# EasyEDA schematic SCH_Nucleo扩展板_V3_2022-10-20.json

## Sheets
1 连接器: TITLE: Sheet_1; REV: 1.0; Date: 2022-09-22; Sheet: 1/1; Company: Your Company
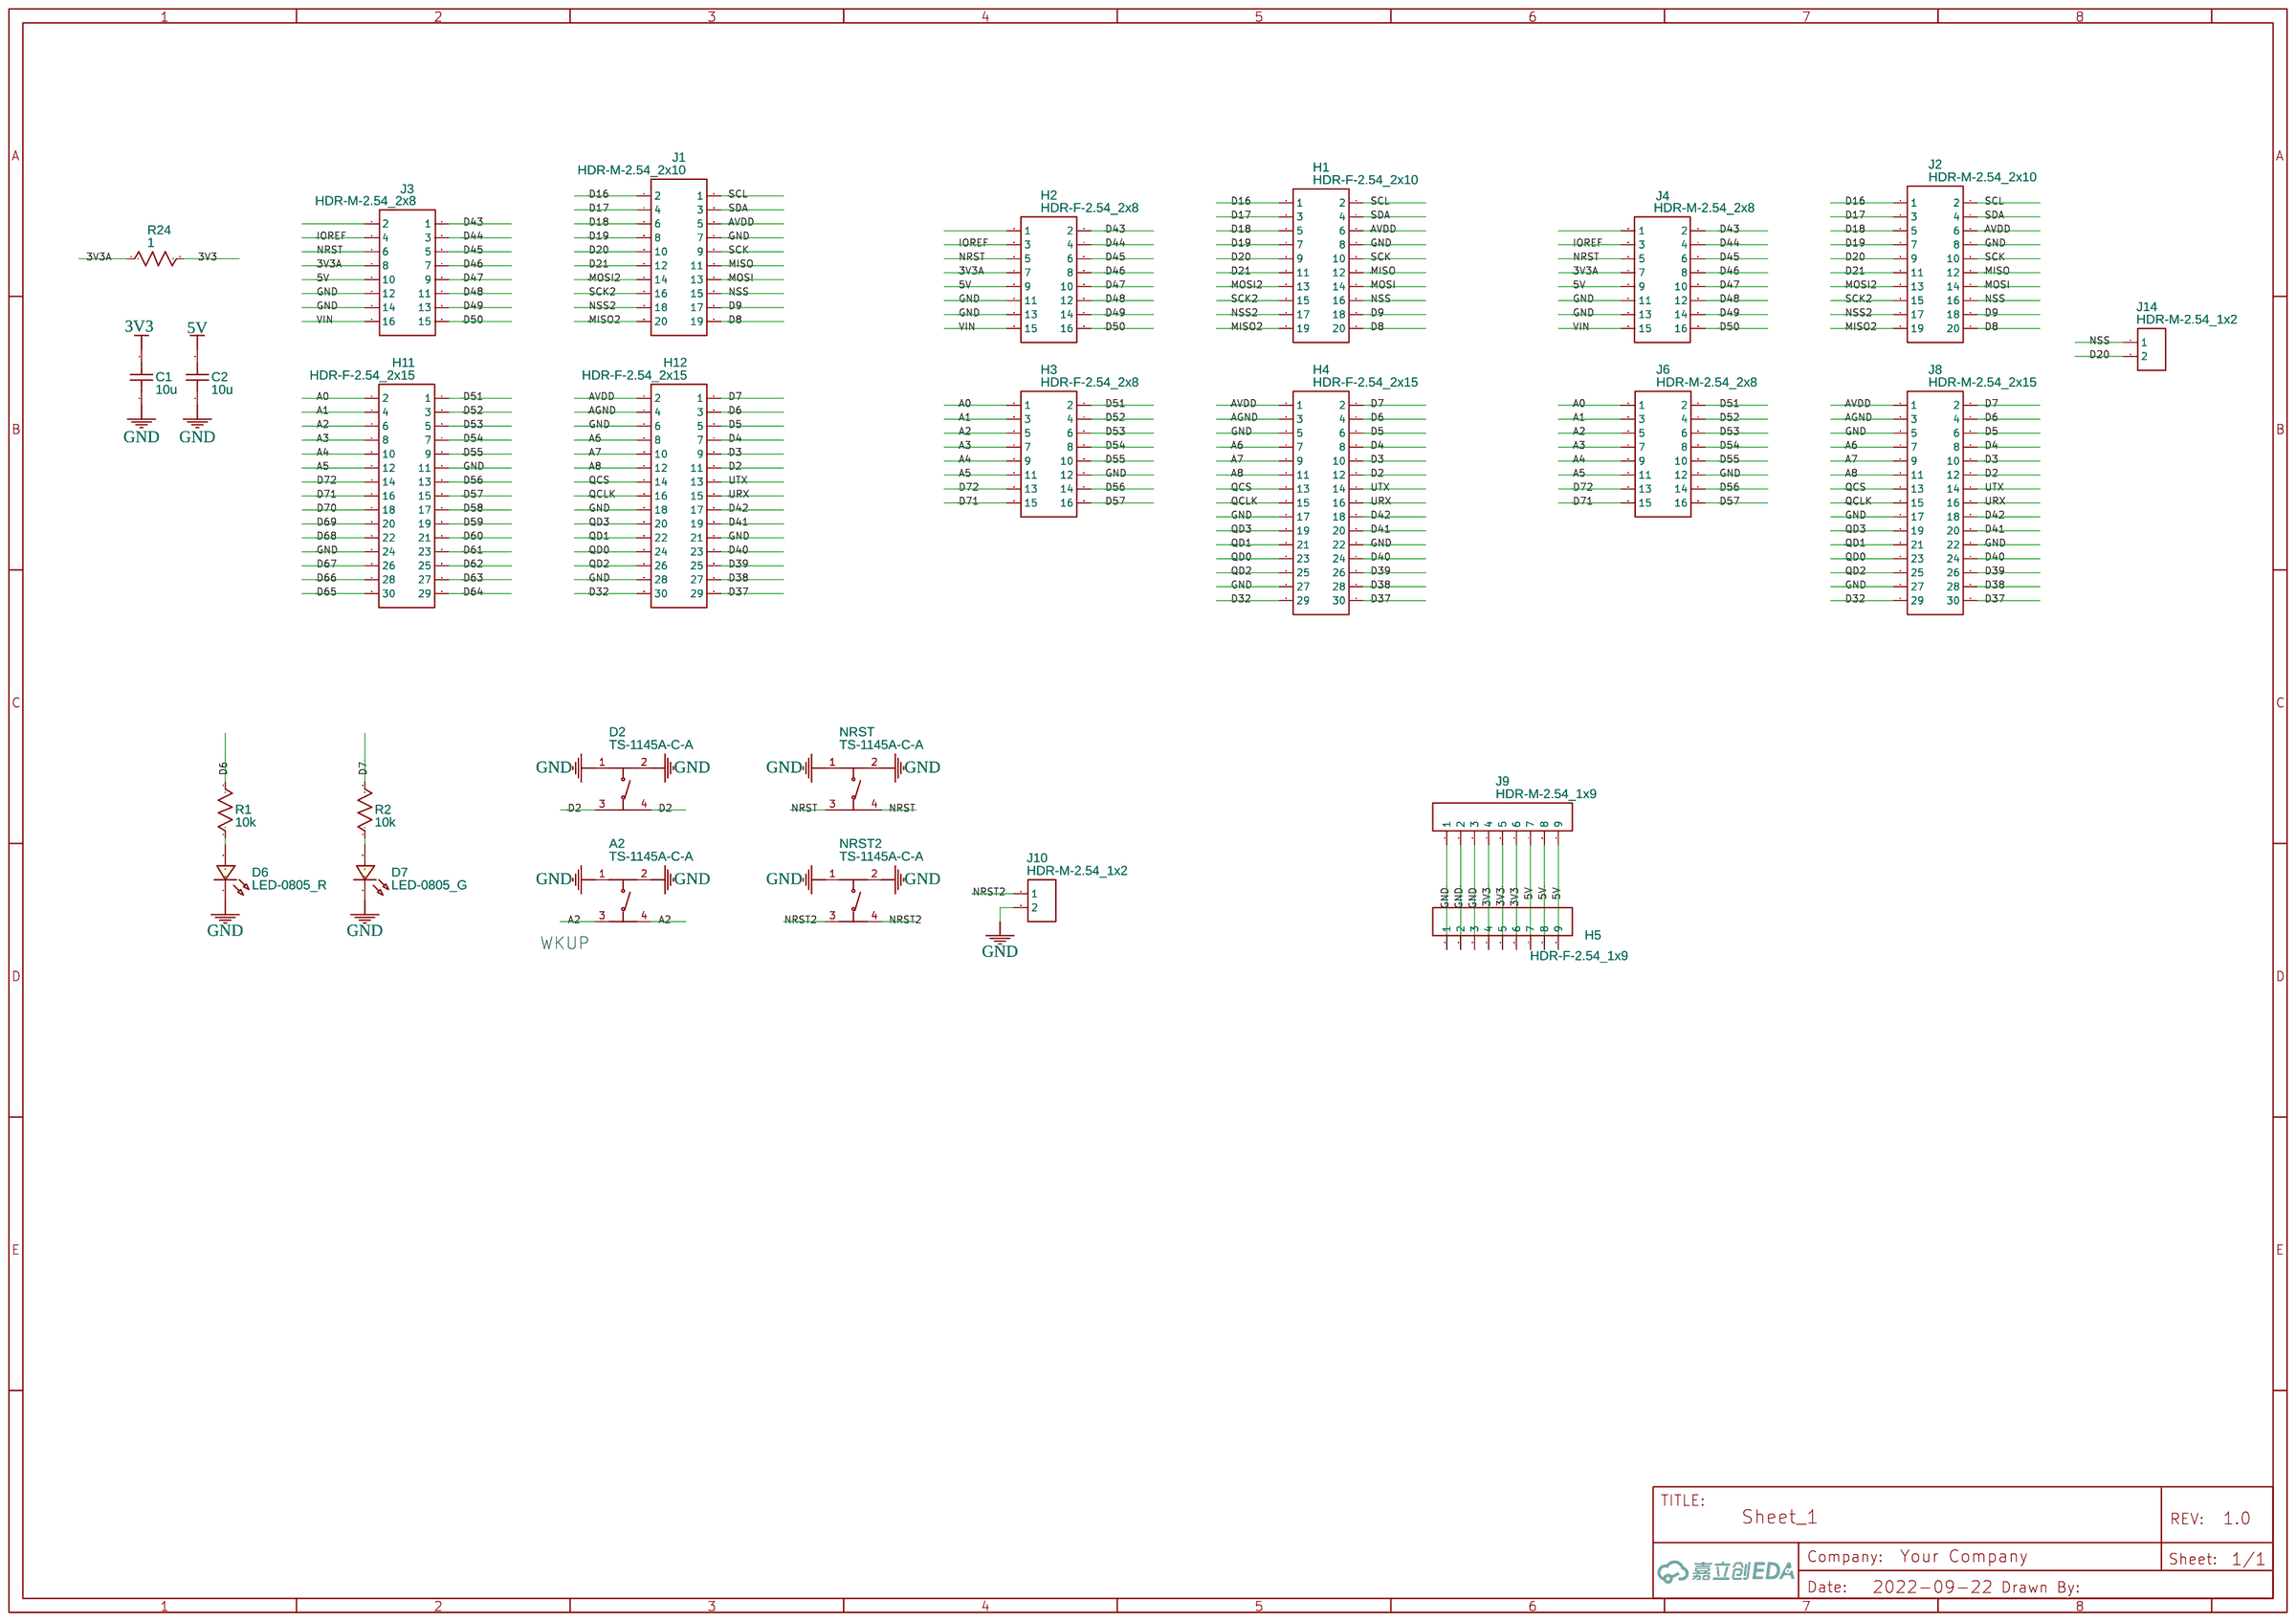
[diagram p0: 连接器]
2 存储: TITLE: Sheet_2; Date: 2022-09-23; Drawn By: minichao
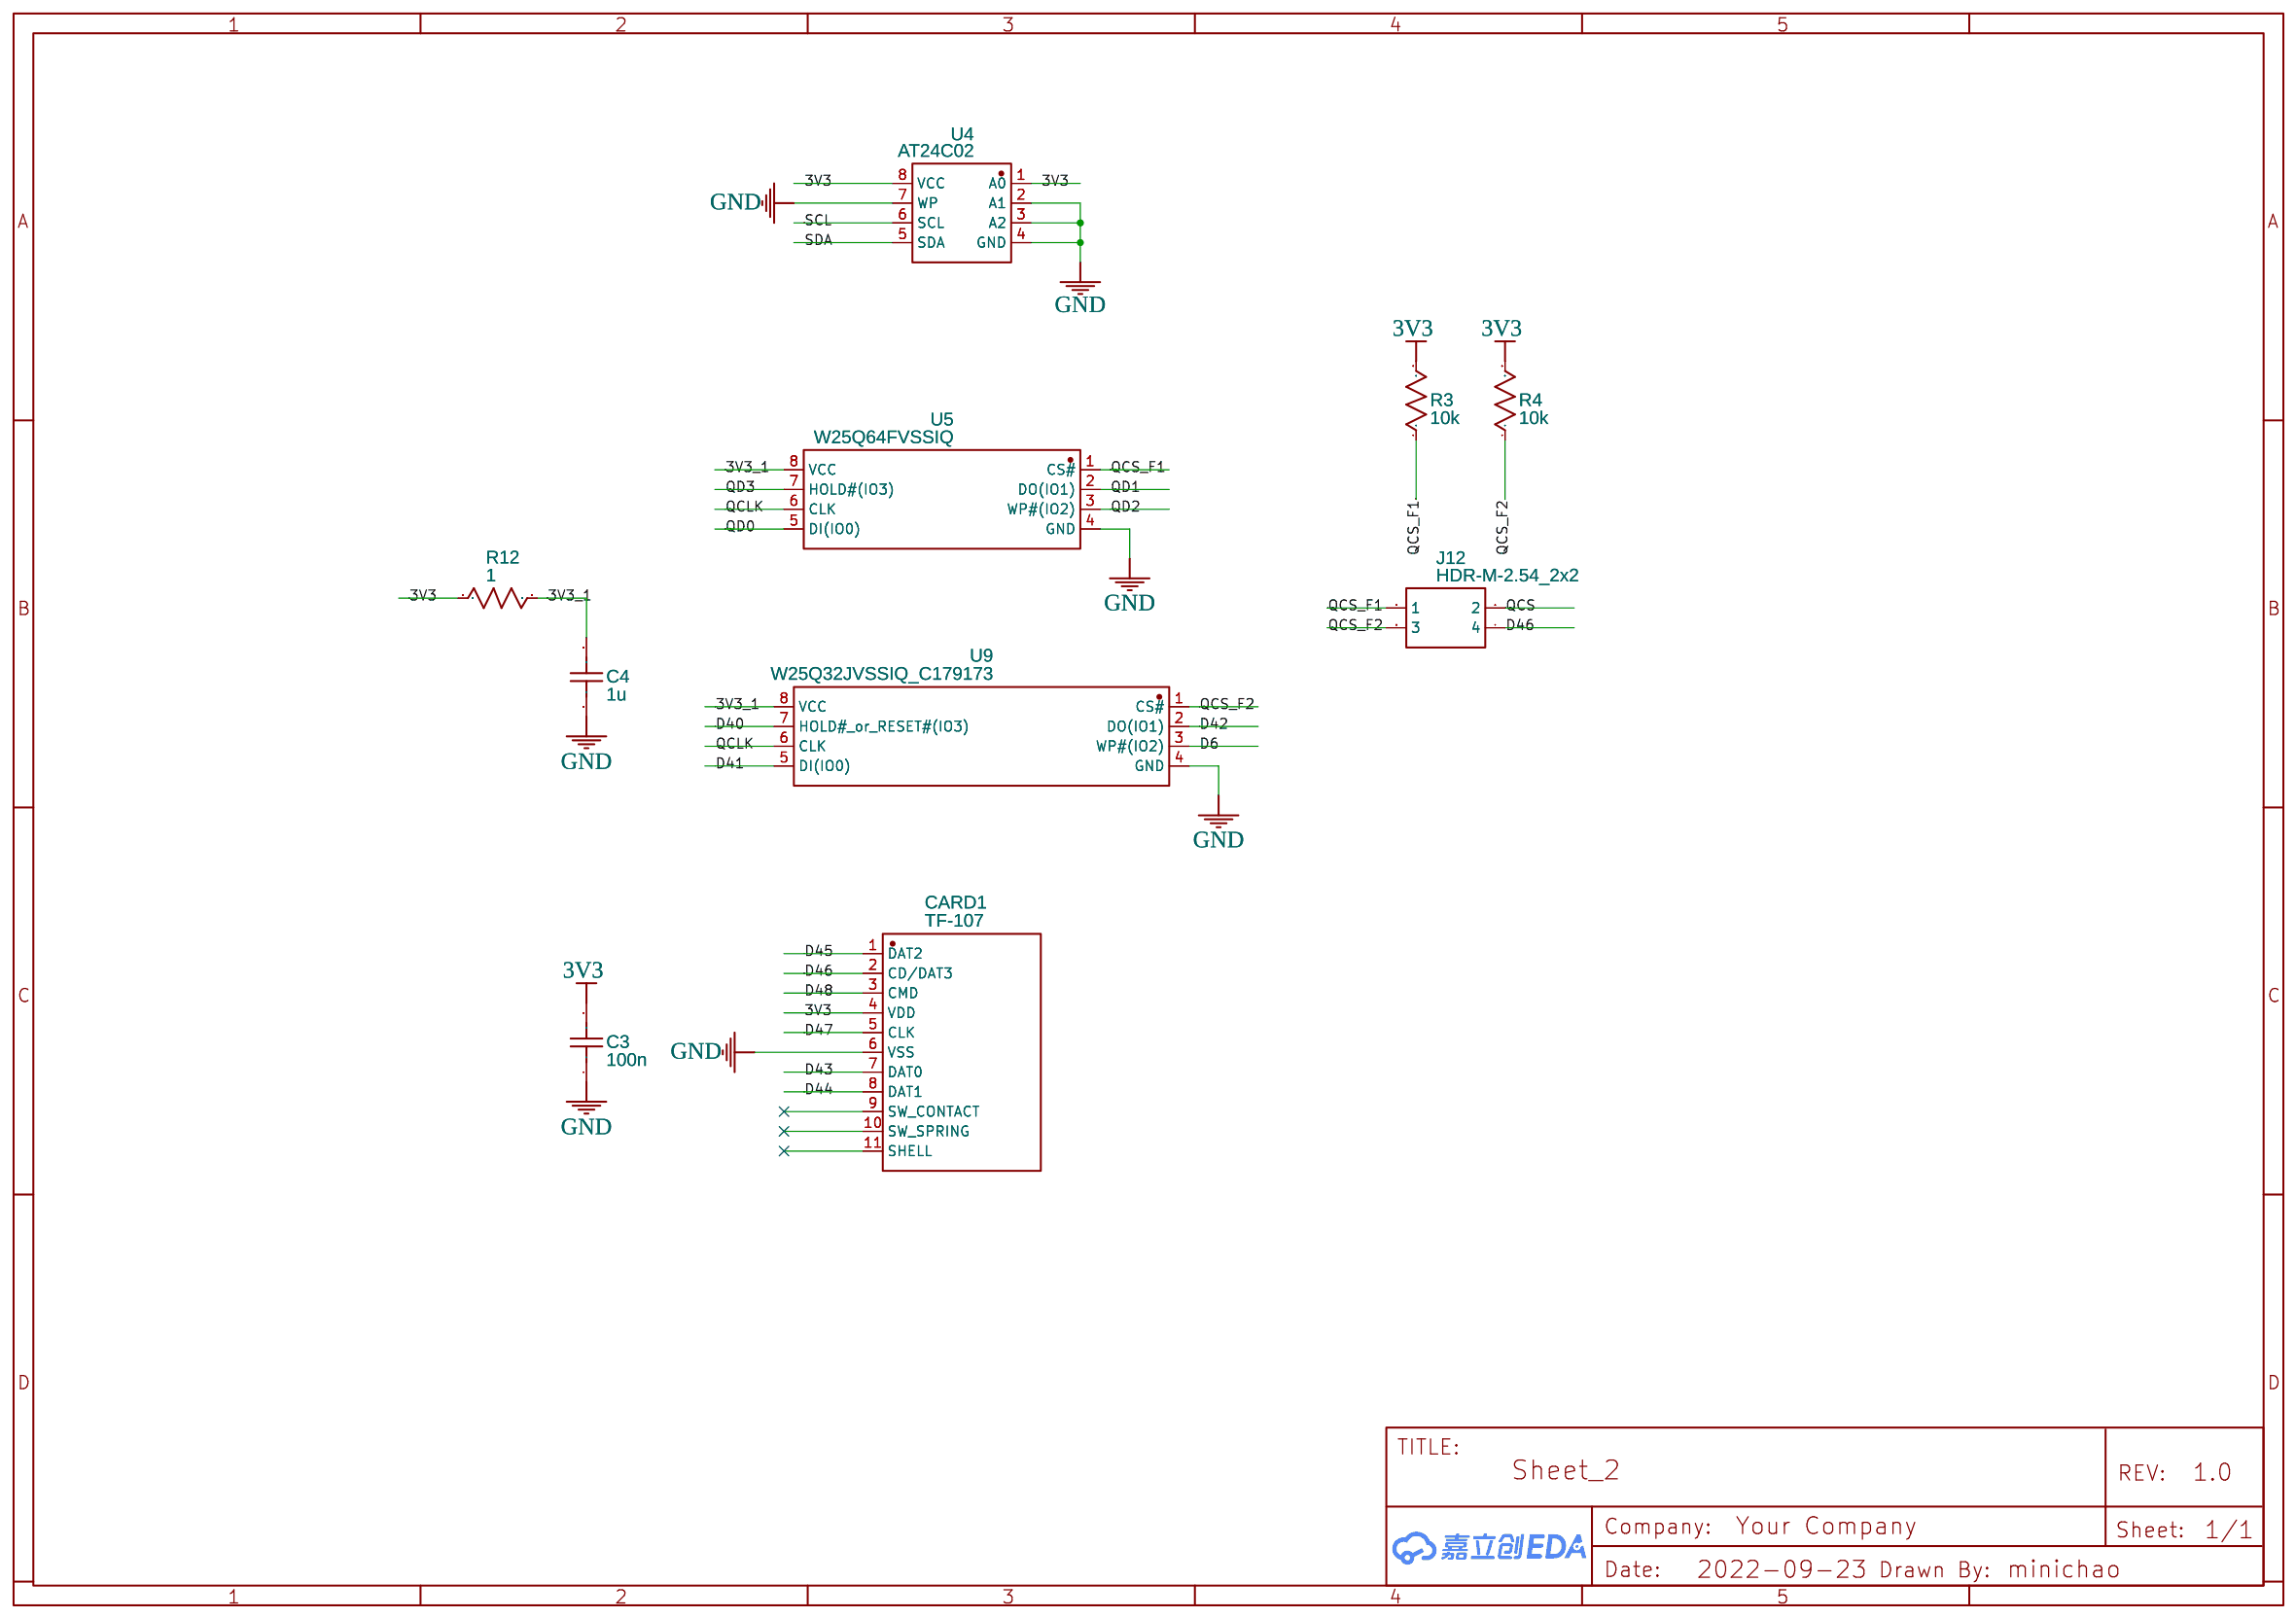
[diagram p1: 存储]
3 mcu: TITLE: Sheet_3; Date: 2022-09-29
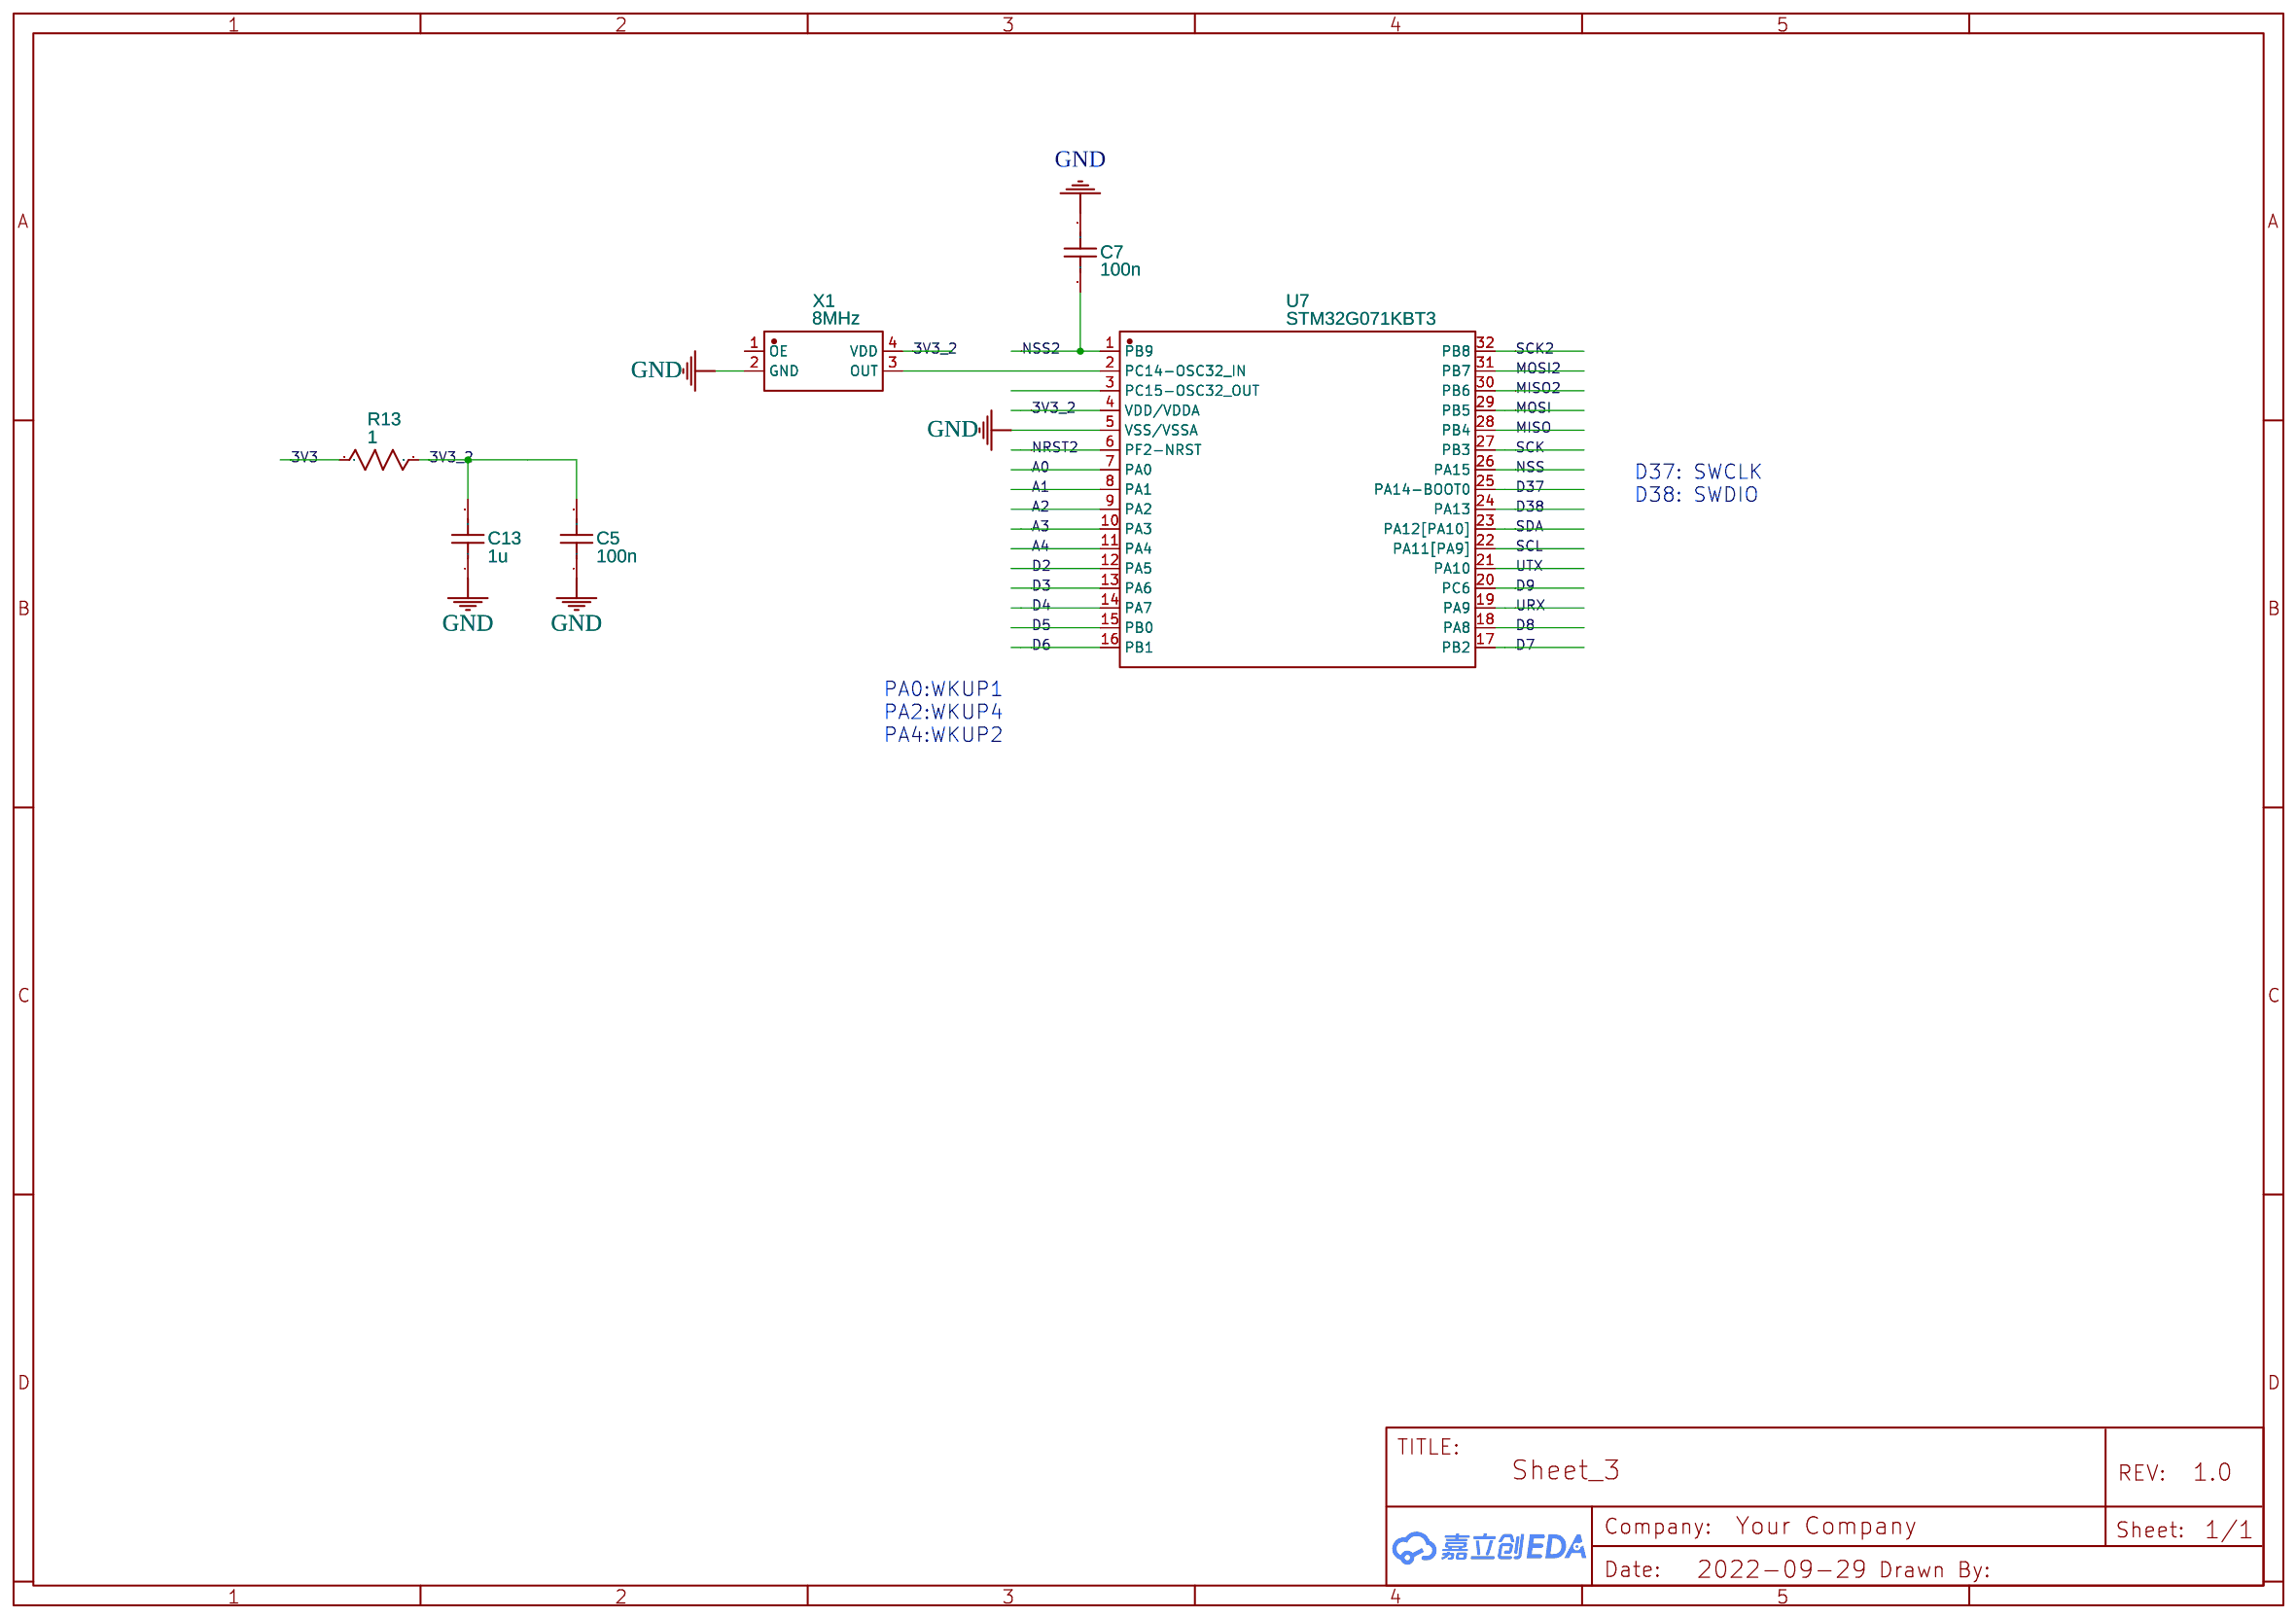
[diagram p2: mcu]
4 音频: Date: 2022-10-16
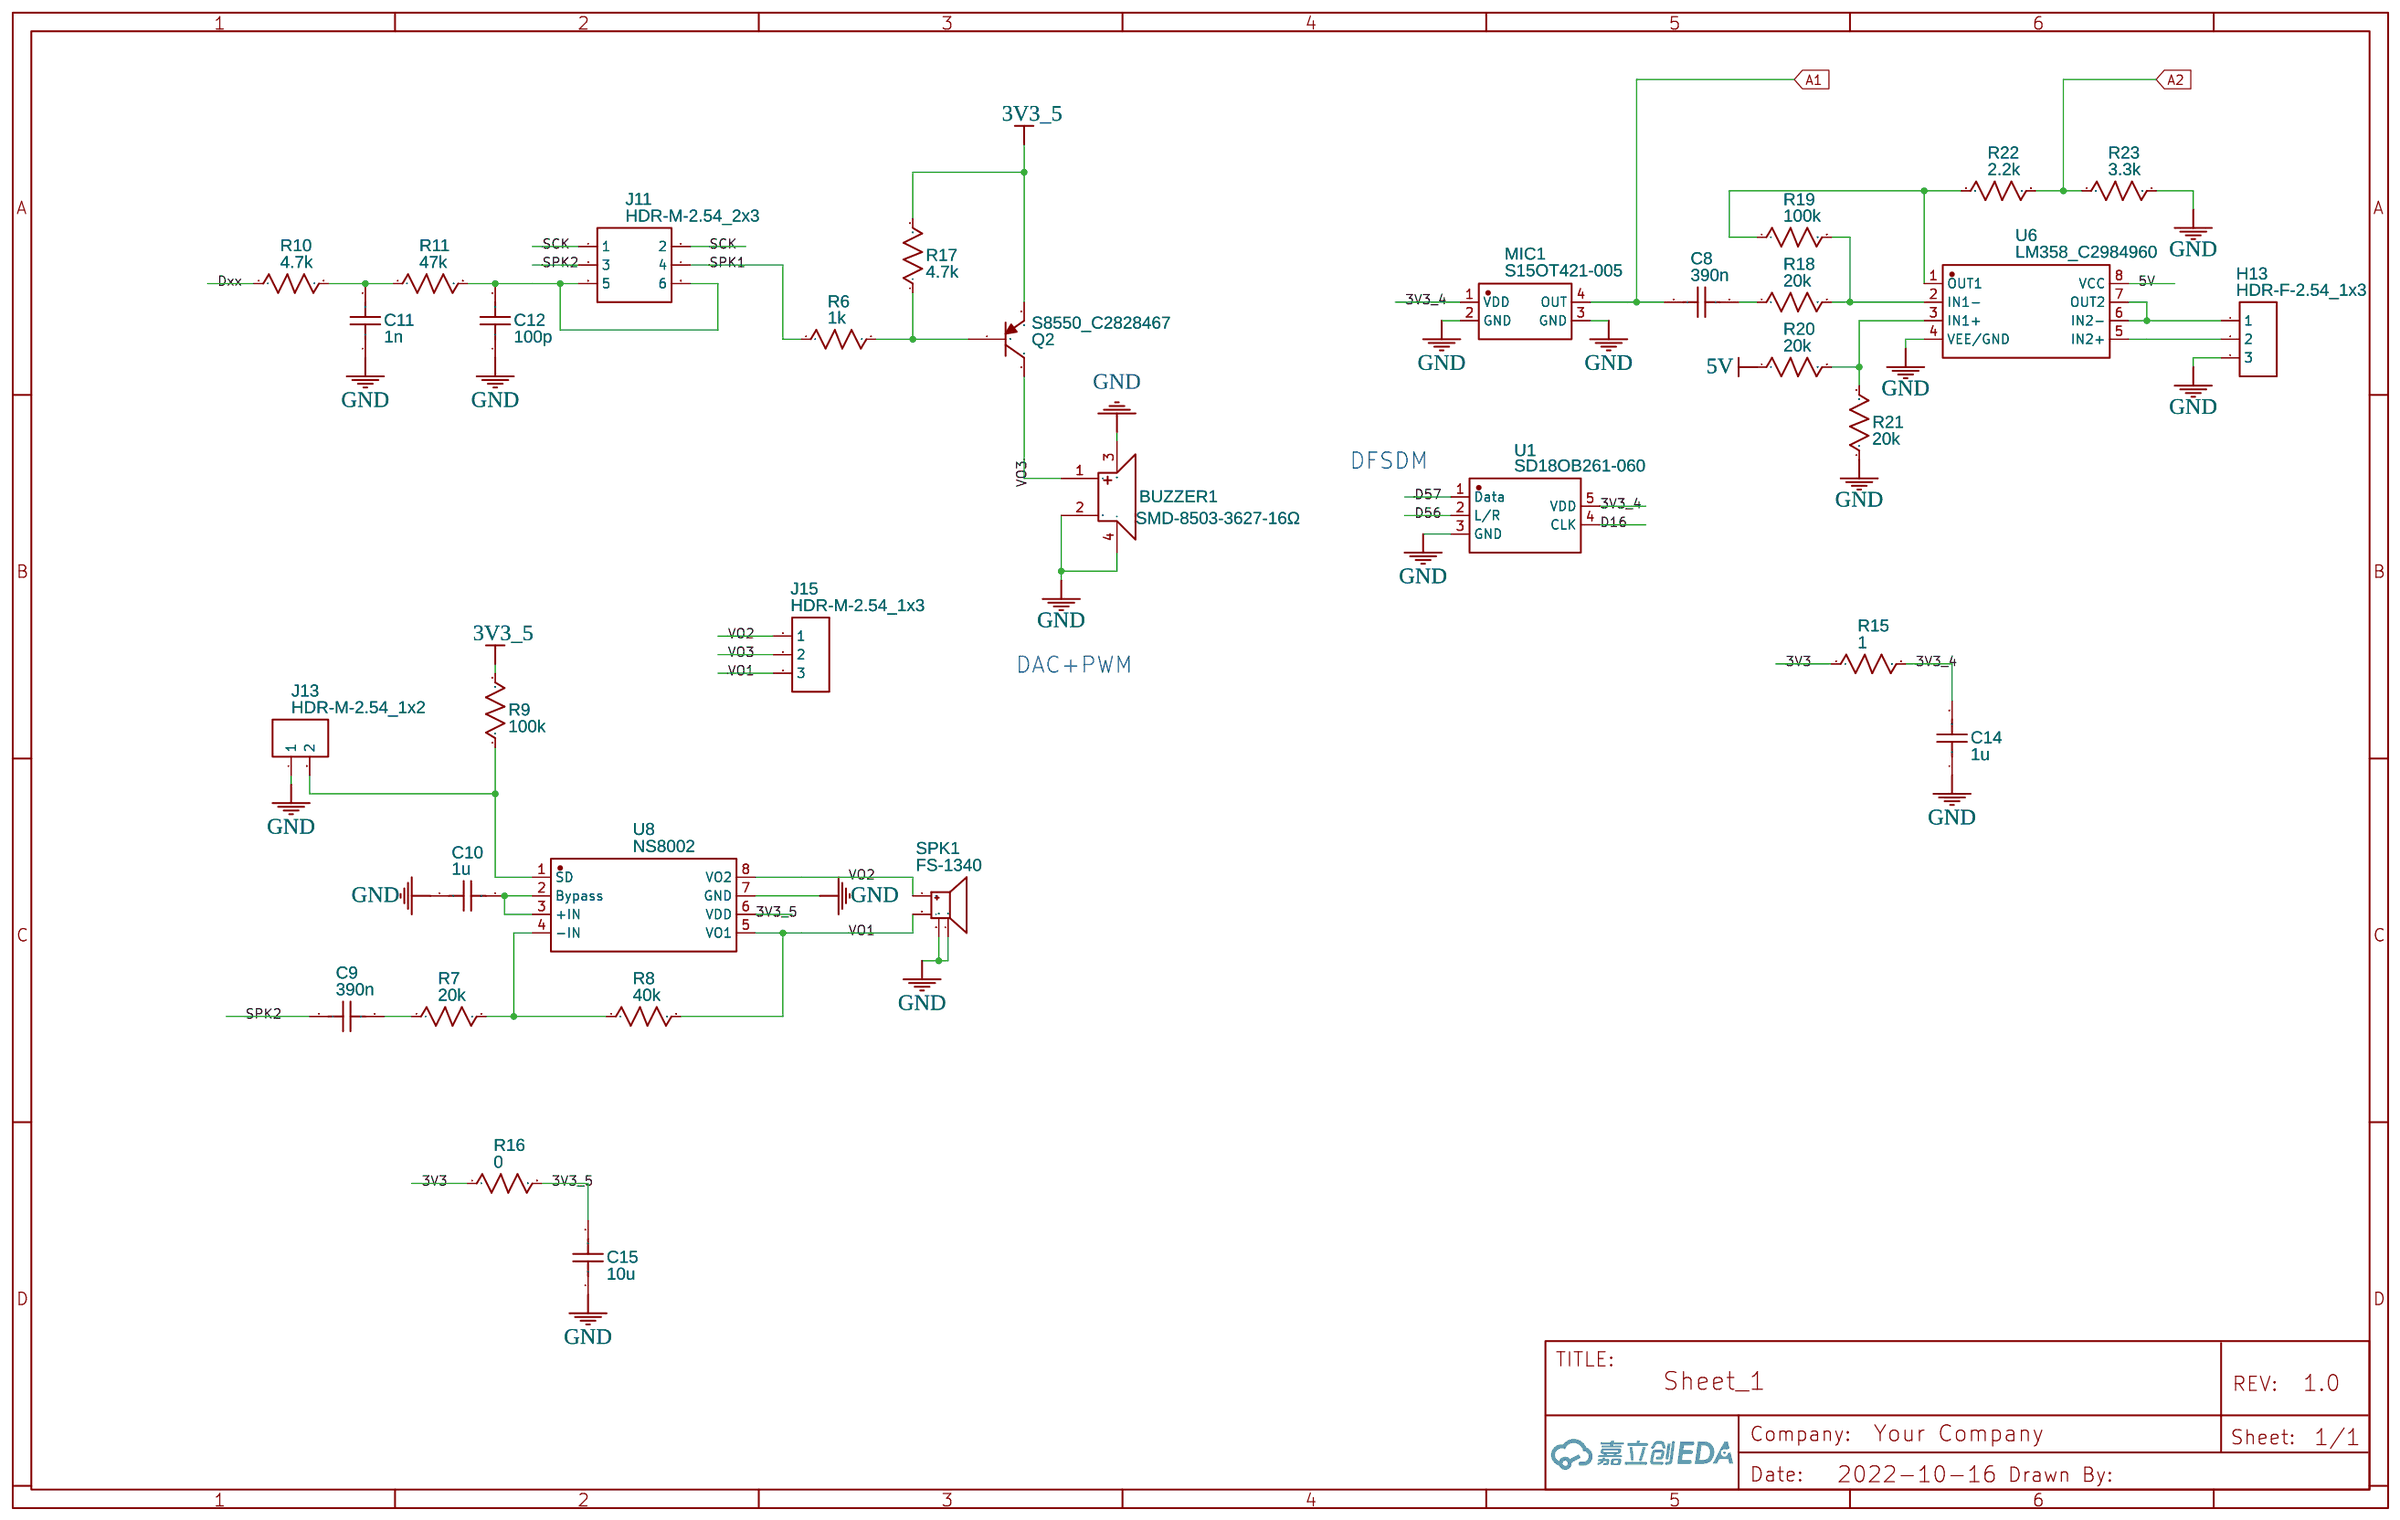
[diagram p3: 音频]
5 显示: Date: 2022-10-17
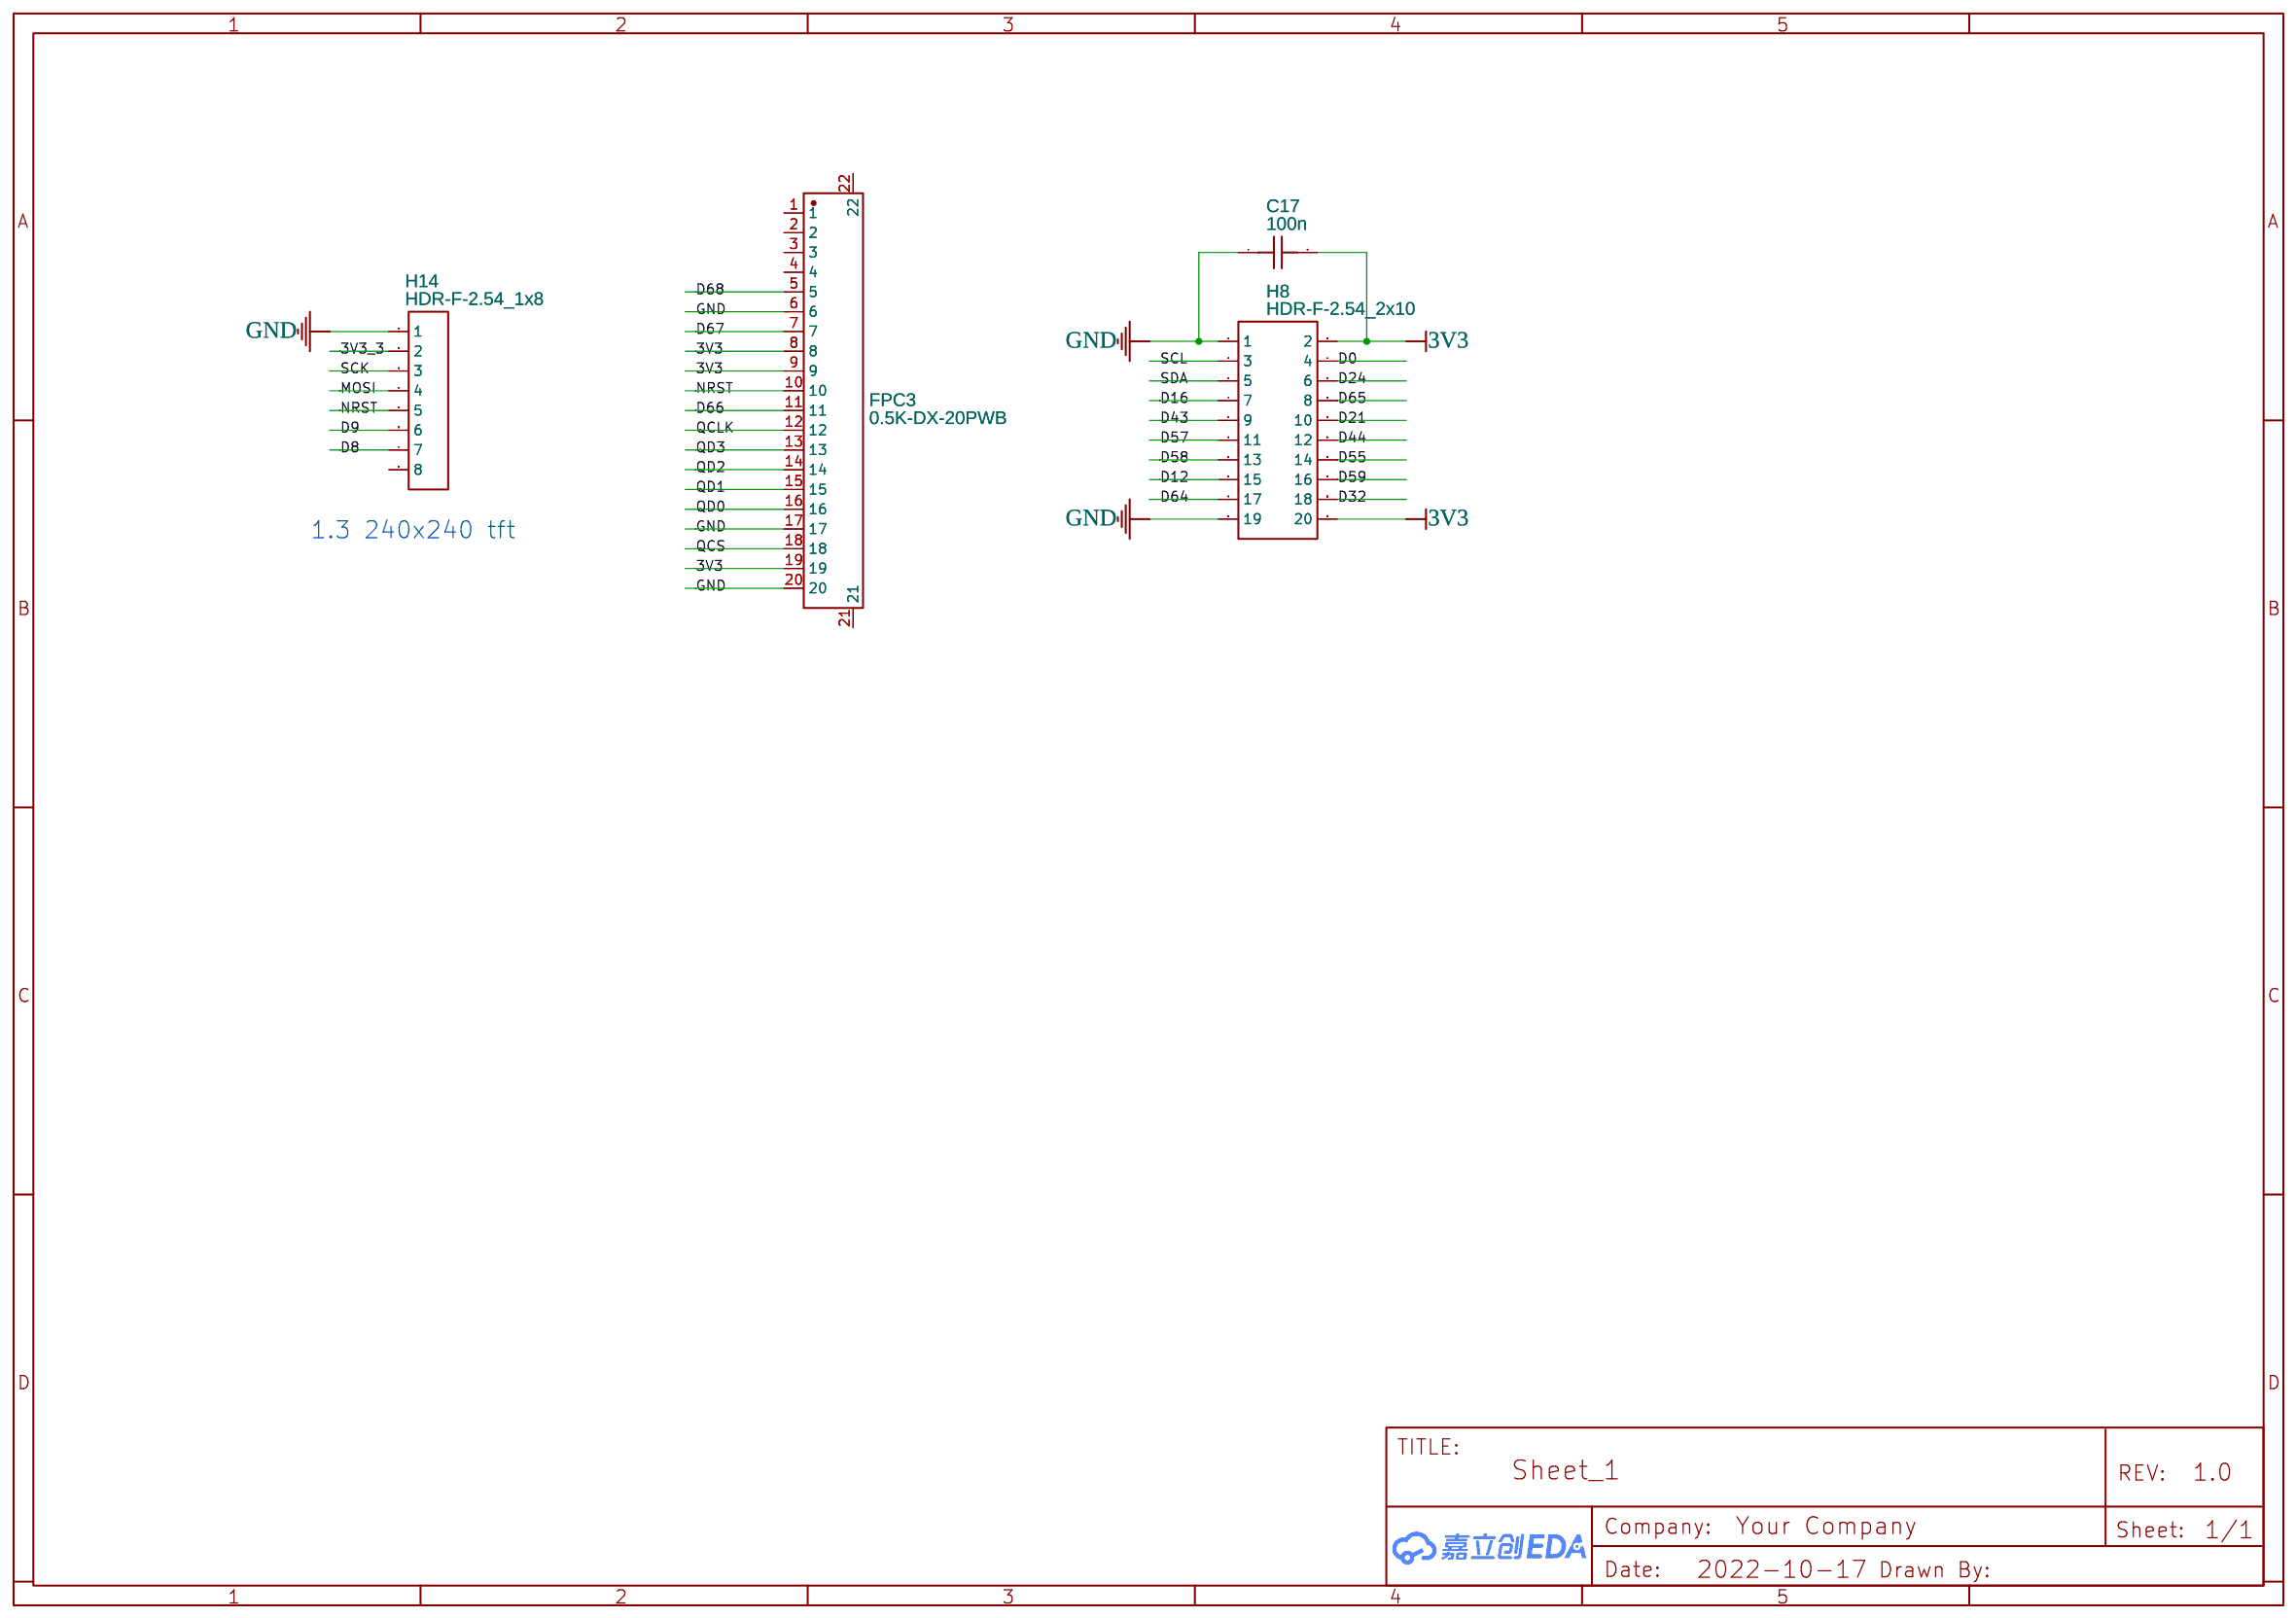
[diagram p4: 显示]
6 无线: Date: 2022-10-17
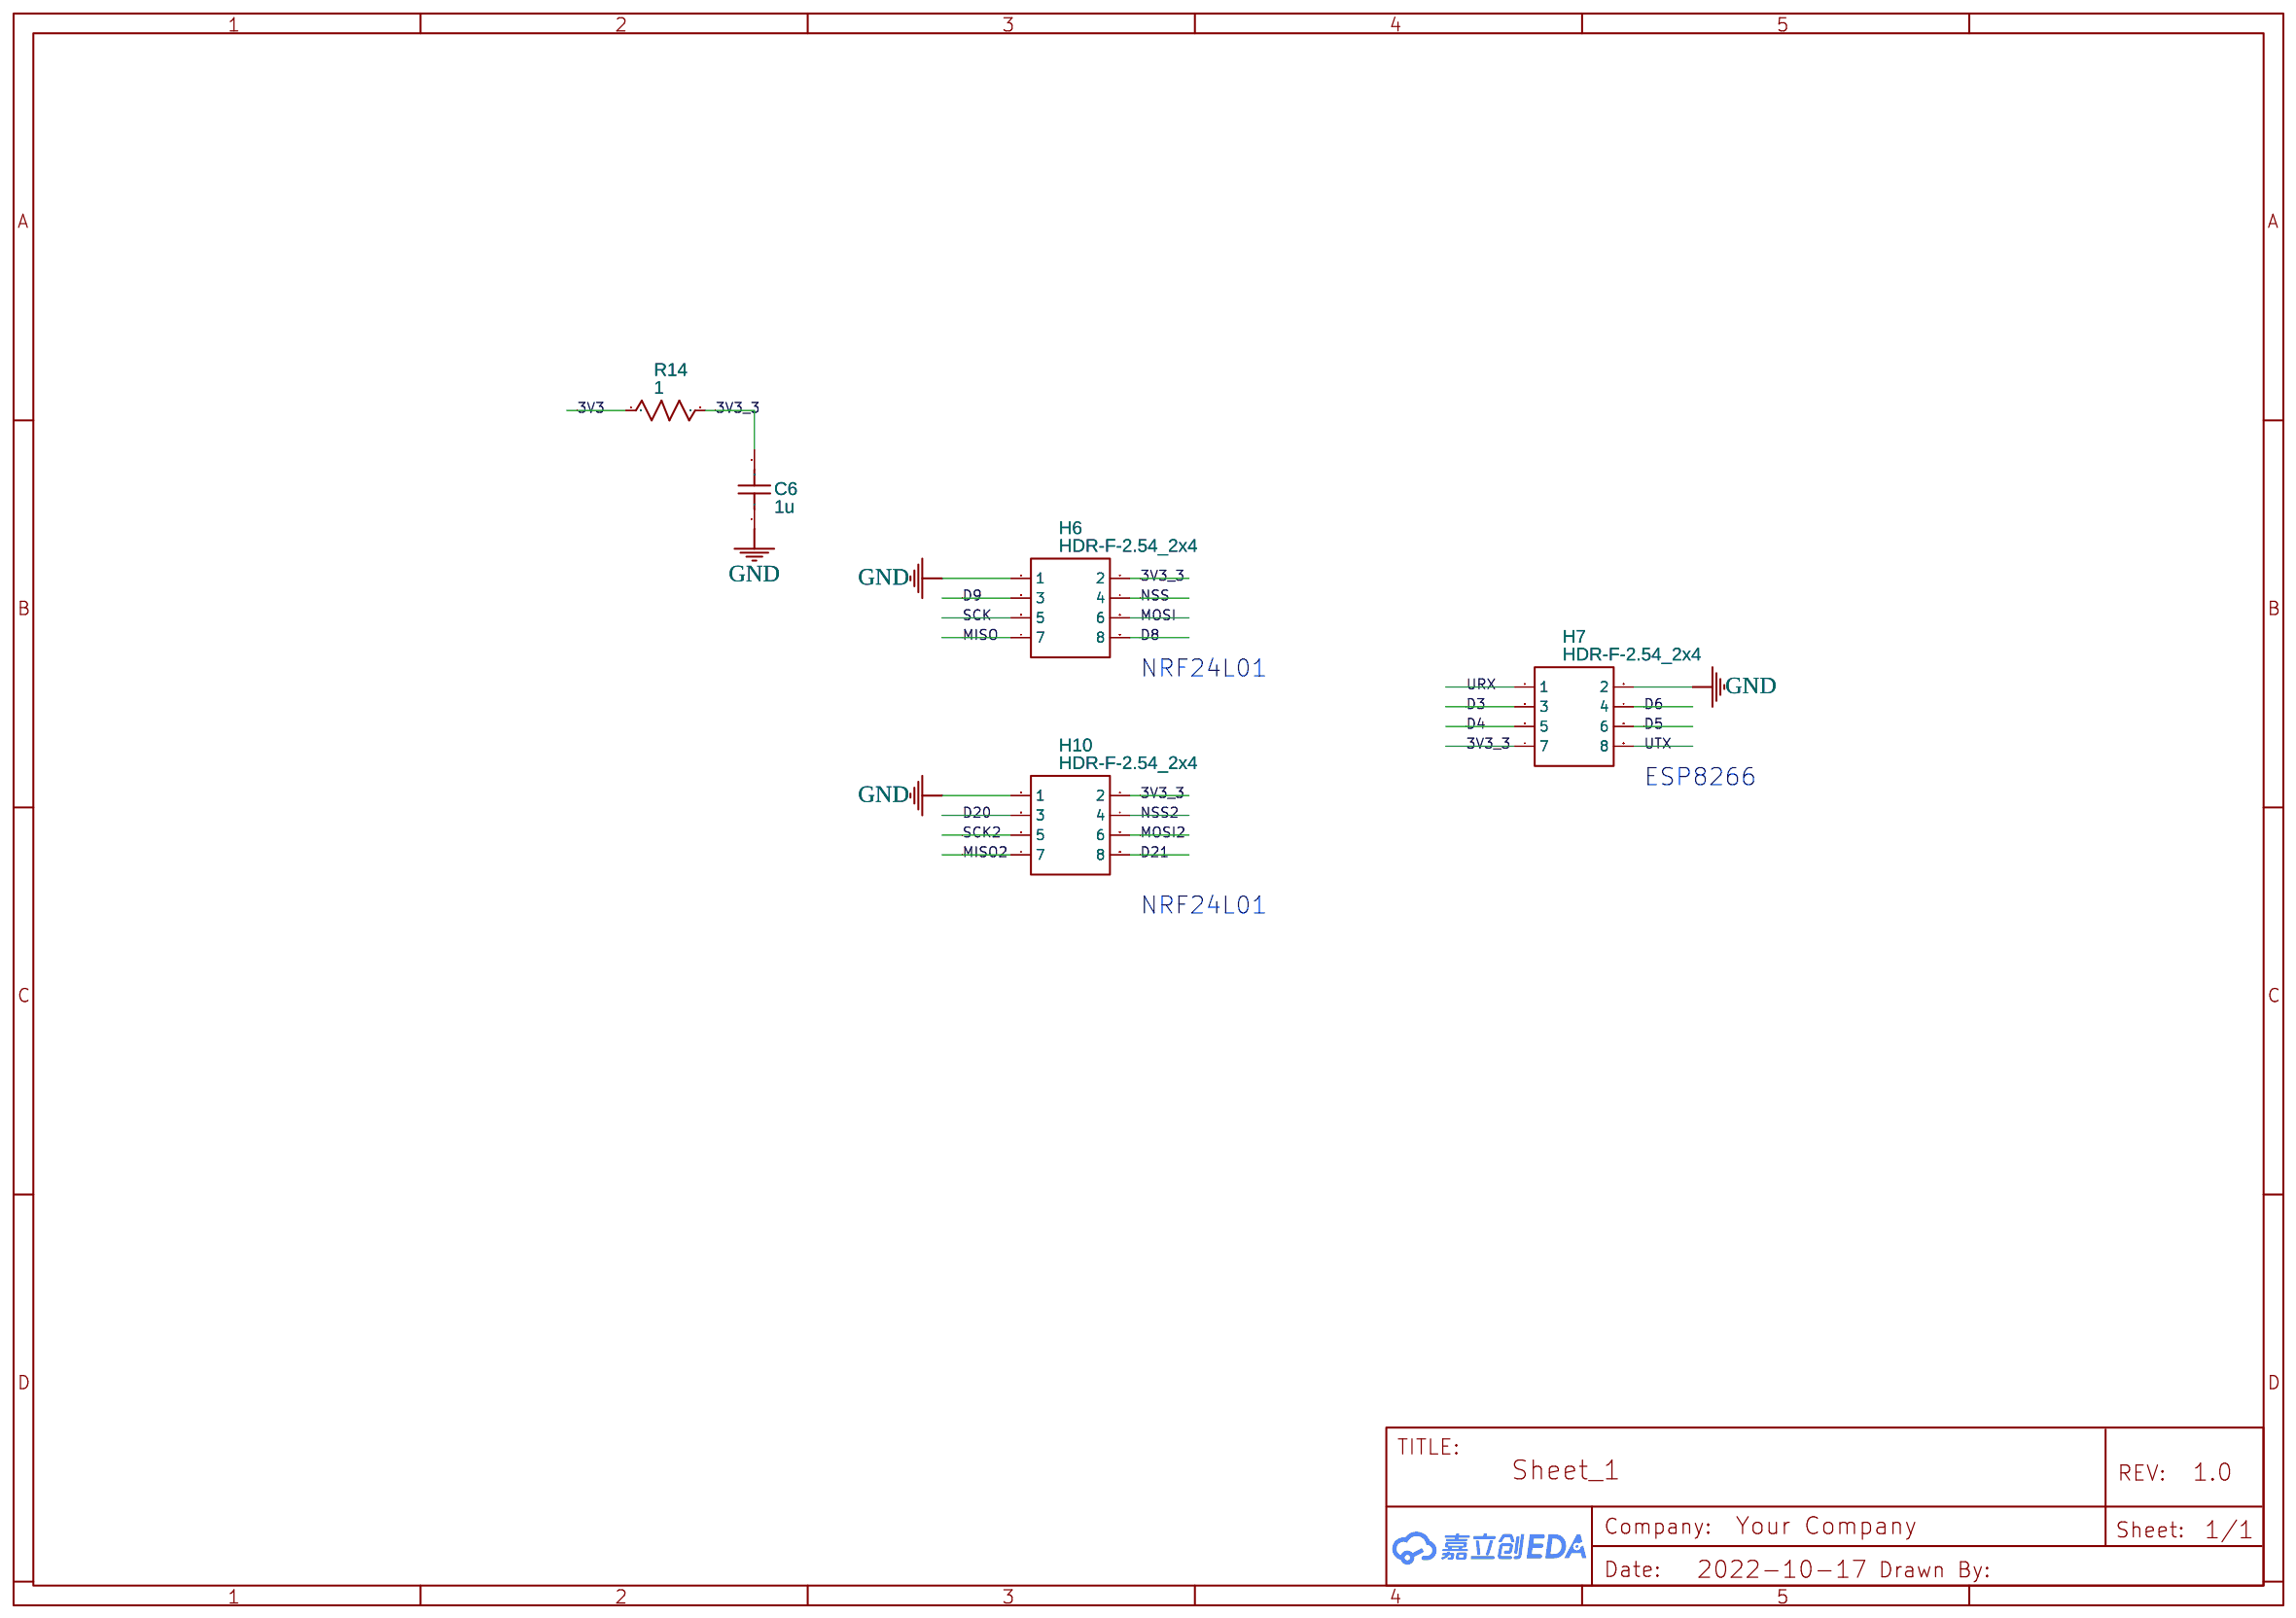
[diagram p5: 无线]
7 小外设模块: Date: 2022-10-17
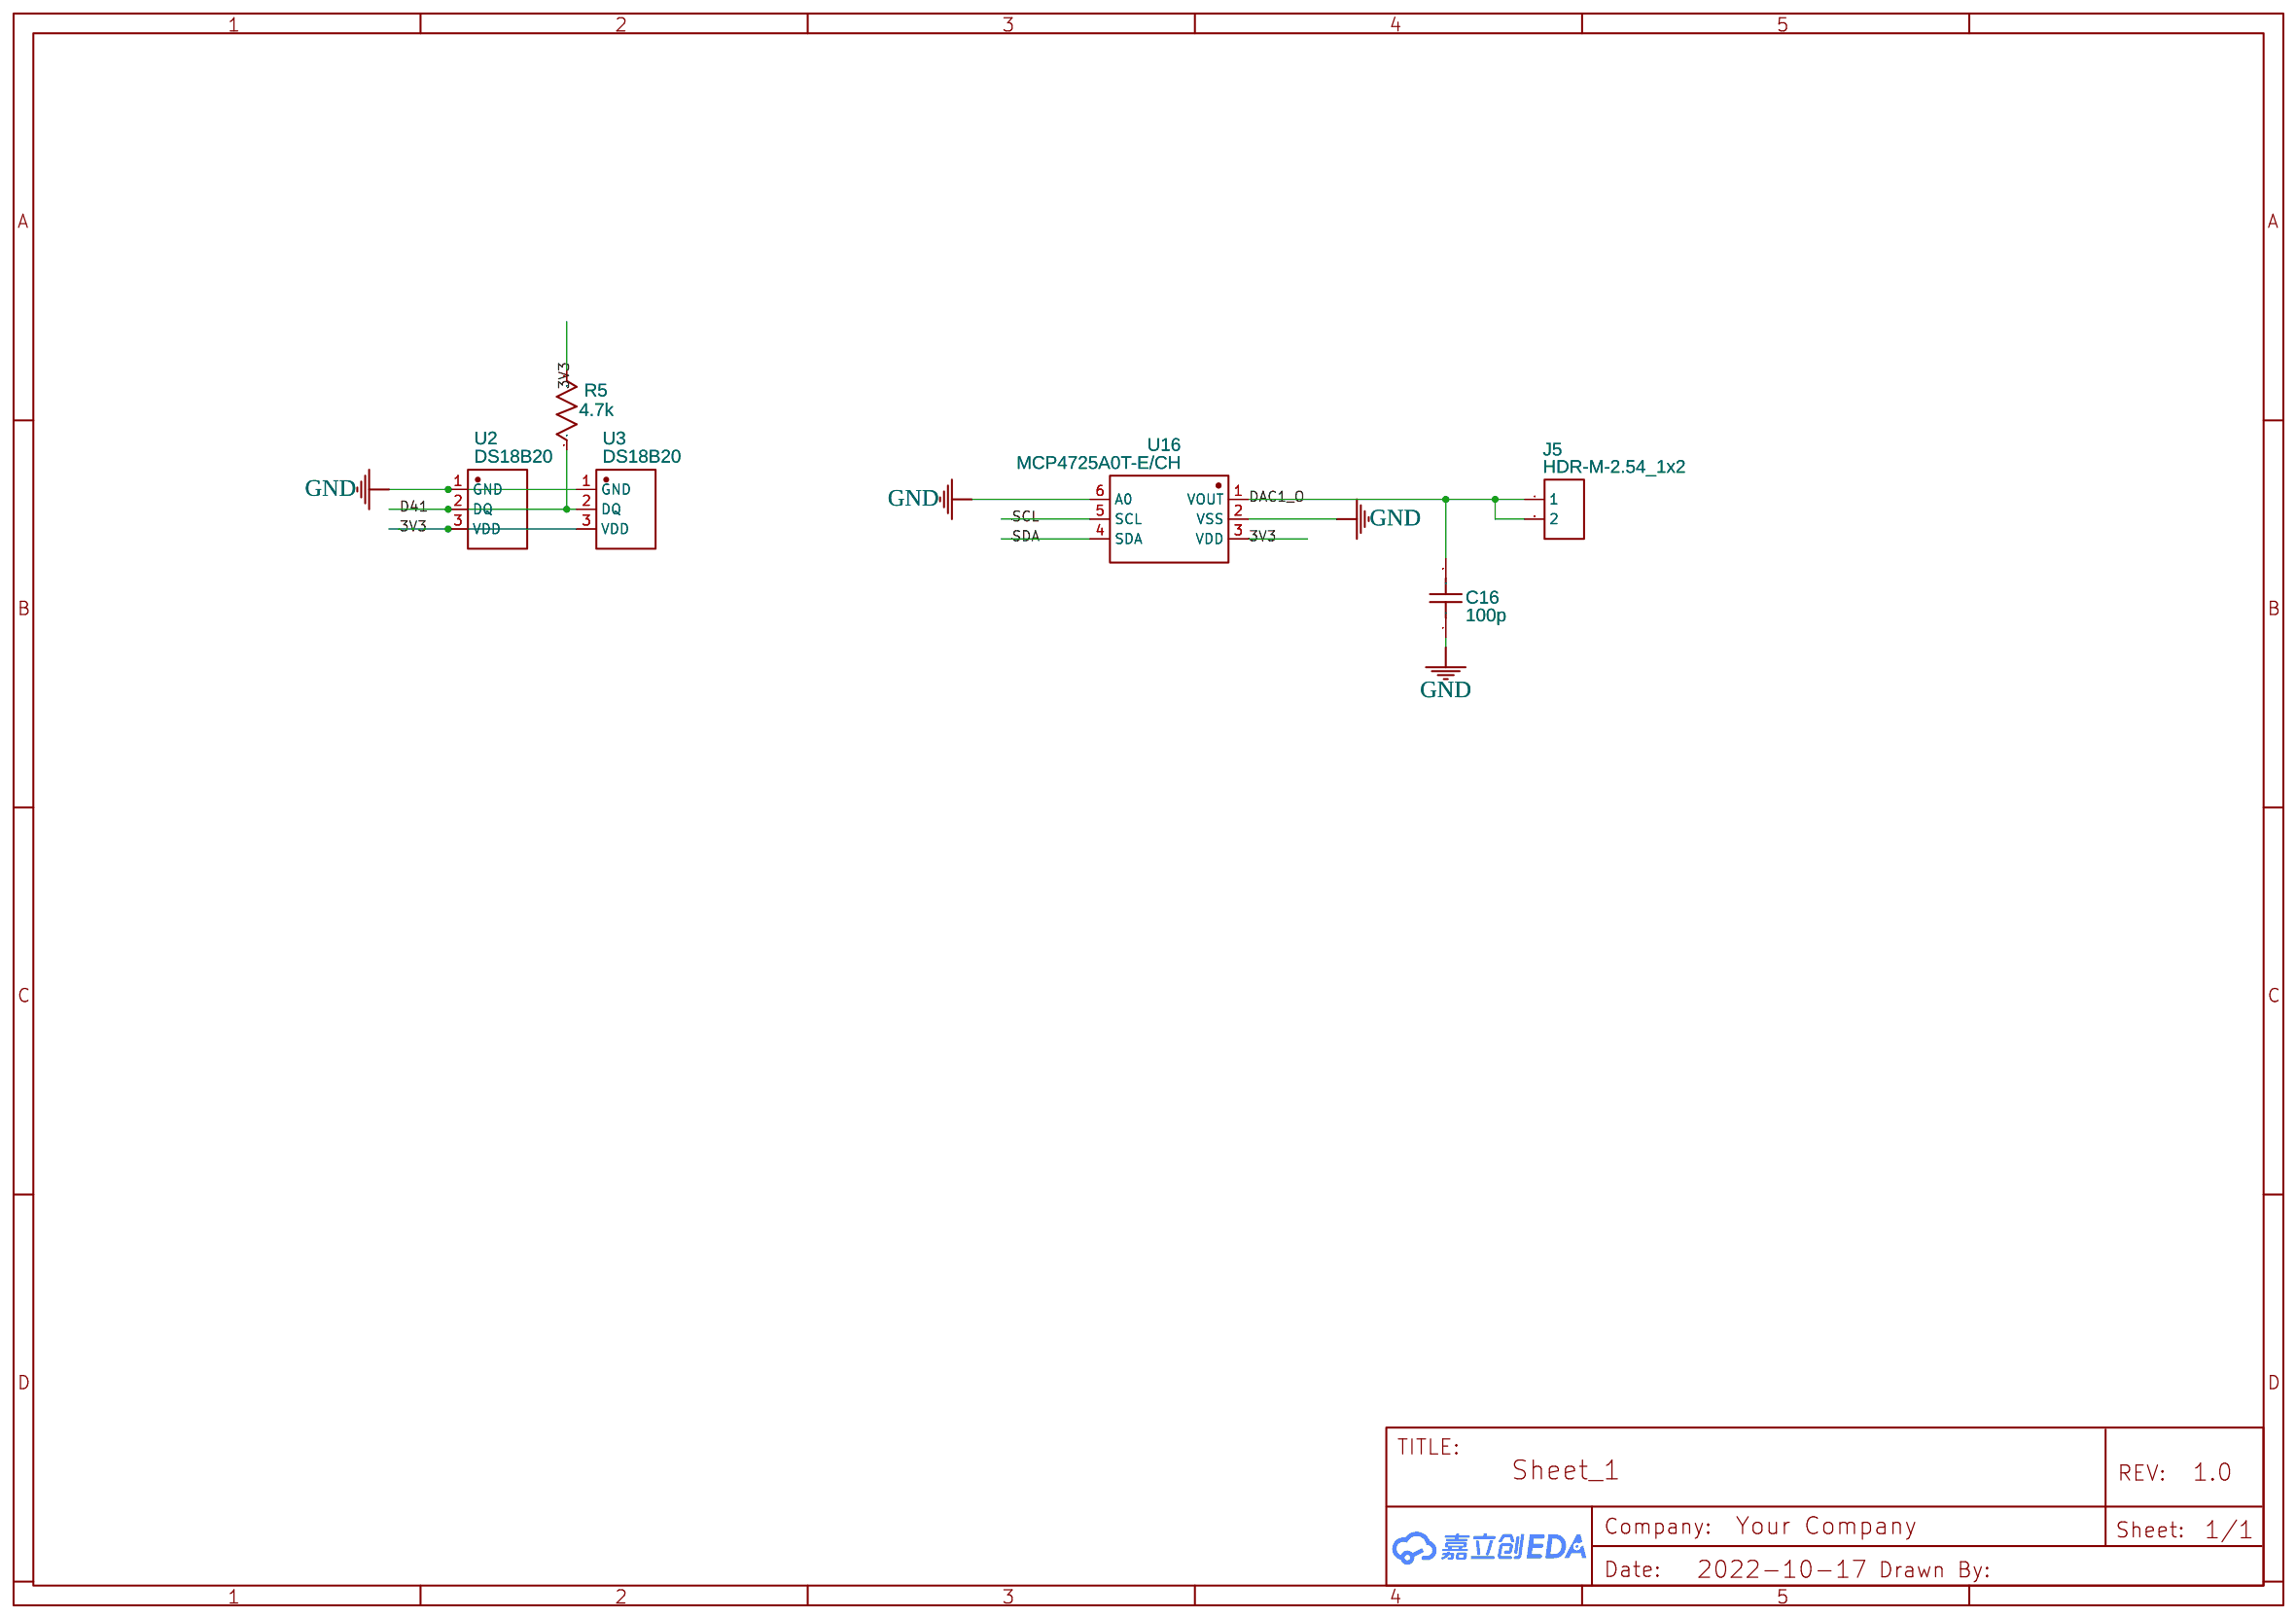
[diagram p6: 小外设模块]

## Parts
sheet mcu
C5  100n  [C0805]
C7  100n  [C0805]
C13  1u  [C0805]
R13  1  [R0805]
U7  STM32G071KBT3  [LQFP-32_L7.0-W7.0-P0.80-LS9.0-BL]
X1  8MHz  [OSC-SMD_4P-L2.5-W2.0-BL]
sheet 存储
C3  100n  [C0805]
C4  1u  [C0805]
CARD1  TF-107  [TF-SMD_TF-107]
J12  HDR-M-2.54_2x2  [HDR-M-2.54_2X2]
R3  10k  [R0805]
R4  10k  [R0805]
R12  1  [R0805]
U4  AT24C02  [SOP-8_L5.0-W4.0-P1.27-LS6.0-BL]
U5  W25Q64FVSSIQ  [SOIC-8_L5.3-W5.3-P1.27-LS8.0-BL]
U9  W25Q32JVSSIQ_C179173  [SOIC-8_L5.3-W5.3-P1.27-LS8.0-BL]
sheet 小外设模块
C16  100p  [C0805]
J5  HDR-M-2.54_1x2  [HDR-M-2.54_1X2]
R5  4.7k  [R0805]
U2  DS18B20  [TO-92-3_L4.9-W3.7-P1.27-L]
U3  DS18B20  [TO-92-3_L4.9-W3.7-P1.27-L]
U16  MCP4725A0T-E/CH  [SOT-23-6_L2.9-W1.6-P0.95-LS2.8-BR]
sheet 无线
C6  1u  [C0805]
H6  HDR-F-2.54_2x4  [HDR-F-2.54_2X4]
H7  HDR-F-2.54_2x4  [HDR-F-2.54_2X4]
H10  HDR-F-2.54_2x4  [HDR-F-2.54_2X4]
R14  1  [R0805]
sheet 显示
C17  100n  [C0805]
FPC3  0.5K-DX-20PWB  [FPC-SMD_20P-P0.50_HDGC_0.5K-DX-20PWB]
H8  HDR-F-2.54_2x10  [HDR-F-2.54_2X10]
H14  HDR-F-2.54_1x8  [HDR-F-2.54_1X8]
sheet 连接器
A2  TS-1145A-C-A  [SW-SMD_4P-L4.2-W3.2-P2.15-LS4.6]
C1  10u  [C0805]
C2  10u  [C0805]
D2  TS-1145A-C-A  [SW-SMD_4P-L4.2-W3.2-P2.15-LS4.6]
D6  LED-0805_R  [LED0805_RED]
D7  LED-0805_G  [LED0805_GREEN]
H1  HDR-F-2.54_2x10  [HDR-F-2.54_2X10]
H2  HDR-F-2.54_2x8  [HDR-F-2.54_2X8]
H3  HDR-F-2.54_2x8  [HDR-F-2.54_2X8]
H4  HDR-F-2.54_2x15  [HDR-F-2.54_2X15]
H5  HDR-F-2.54_1x9  [HDR-F-2.54_1X9]
H11  HDR-F-2.54_2x15  [HDR-F-2.54_2X15]
H12  HDR-F-2.54_2x15  [HDR-F-2.54_2X15]
J1  HDR-M-2.54_2x10  [HDR-M-2.54_2X10]
J2  HDR-M-2.54_2x10  [HDR-M-2.54_2X10]
J3  HDR-M-2.54_2x8  [HDR-M-2.54_2X8]
J4  HDR-M-2.54_2x8  [HDR-M-2.54_2X8]
J6  HDR-M-2.54_2x8  [HDR-M-2.54_2X8]
J8  HDR-M-2.54_2x15  [HDR-M-2.54_2X15]
J9  HDR-M-2.54_1x9  [HDR-M-2.54_1X9]
J10  HDR-M-2.54_1x2  [HDR-M-2.54_1X2]
J14  HDR-M-2.54_1x2  [HDR-M-2.54_1X2]
NRST  TS-1145A-C-A  [SW-SMD_4P-L4.2-W3.2-P2.15-LS4.6]
NRST2  TS-1145A-C-A  [SW-SMD_4P-L4.2-W3.2-P2.15-LS4.6]
R1  10k  [R0805]
R2  10k  [R0805]
R24  1  [R0805]
sheet 音频
BUZZER1  SMD-8503-3627-16Ω  [BUZ-SMD_4P-L8.5-W8.5-BR-1]
C8  390n  [C0805]
C9  390n  [C0805]
C10  1u  [C0805]
C11  1n  [C0805]
C12  100p  [C0805]
C14  1u  [C0805]
C15  10u  [C0805]
H13  HDR-F-2.54_1x3  [HDR-F-2.54_1X3]
J11  HDR-M-2.54_2x3  [HDR-M-2.54_2X3]
J13  HDR-M-2.54_1x2  [HDR-M-2.54_1X2]
J15  HDR-M-2.54_1x3  [HDR-M-2.54_1X3]
MIC1  S15OT421-005  [MIC-SMD_4P-L2.8-W1.9_S15OT421-005]
Q2  S8550_C2828467  [SOT-23-3_L2.9-W1.3-P1.90-LS2.4-BR]
R6  1k  [R0805]
R7  20k  [R0805]
R8  40k  [R0805]
R9  100k  [R0805]
R10  4.7k  [R0805]
R11  47k  [R0805]
R15  1  [R0805]
R16  0  [R0805]
R17  4.7k  [R0805]
R18  20k  [R0805]
R19  100k  [R0805]
R20  20k  [R0805]
R21  20k  [R0805]
R22  2.2k  [R0805]
R23  3.3k  [R0805]
SPK1  FS-1340  [BUZ-SMD_4P-L13.0-W13.0-P11.4-BL]
U1  SD18OB261-060  [MIC-SMD_SD18OB261-060]
U6  LM358_C2984960  [SOP-8_L4.9-W3.9-P1.27-LS6.0-BL]
U8  NS8002  [SOP-8_L4.9-W3.9-P1.27-LS6.0-BL]

## Library data of the parts
C1-C6 C13-C15 = C_0805_US: Supplier Part: C2913555; Supplier: LCSC; Contributor: LCEDA_Lib; Manufacturer Part: 0805B105M500NT; Manufacturer: FH(风华)
C7-C12 C16 C17 = C_0805_US: Contributor: LCEDA_Lib
R3-R24 = R_0805_US: Contributor: LCEDA_Lib
U7 = STM32G071KBT3: Supplier: LCSC; Supplier Part: C724238; Manufacturer: STMicroelectronics; Contributor: LCSC; JLCPCB Part Class: Extended Part
X1 = S2H008000I3CHE-T: Supplier: LCSC; Supplier Part: C253908; Manufacturer: Harmony Elec; Contributor: LCSC; JLCPCB Part Class: Extended Part
CARD1 = TF-107: Supplier: LCSC; Supplier Part: C266615; Manufacturer: XUNPU(讯普); Contributor: LCSC; JLCPCB Part Class: Extended Part
J12 = HDR-M-2.54_2x2: Supplier Part: C66690; Supplier: LCSC; Contributor: LCEDA_Lib
U4 = AT24C02: Supplier: LCSC; Supplier Part: C688857; Manufacturer: IDCHIP; Contributor: LCSC; JLCPCB Part Class: Extended Part
U5 = W25Q64FVSSIQ: Supplier: LCSC; Supplier Part: C2943203; Manufacturer: WINBOND(华邦); link: https://atta.szlcsc.com//upload/public/pdf/source/20220124/B586DF8D2E26F9242C002B2D869830EA.pdf; Contributor: LCSC; JLCPCB Part Class: Extended Part
U9 = W25Q32JVSSIQ_C179173: Supplier: LCSC; Supplier Part: C179173; Manufacturer: Winbond Elec; Manufacturer Part: W25Q32JVSSIQ; Contributor: LCSC; JLCPCB Part Class: Extended Part
J5 J10 J13 J14 = HDR-M-2.54_1x2: Supplier Part: C124375; Supplier: LCSC; Contributor: LCEDA_Lib
U2 U3 = DS18B20: Supplier: LCSC; Supplier Part: C376006; Manufacturer: Youtai Semiconductor Co., Ltd.; Contributor: LCSC; JLCPCB Part Class: Extended Part
U16 = MCP4725A0T-E/CH: Supplier: LCSC; Manufacturer: MICROCHIP; Contributor: LCSC; Supplier Part: C144198; JLCPCB Part Class: Extended Part
H6 H7 H10 = HDR-F-2.54_2x4: Supplier Part: C239344; Supplier: LCSC; Contributor: LCEDA_Lib
FPC3 = 0.5K-DX-20PWB: Supplier: LCSC; Supplier Part: C2911845; Manufacturer: HDGC(华德共创); Contributor: LCSC; JLCPCB Part Class: Extended Part
H1 H8 = HDR-F-2.54_2x10: Supplier Part: C30867; Supplier: LCSC; Contributor: LCEDA_Lib
H14 = HDR-F-2.54_1x8: Supplier Part: C225505; Supplier: LCSC; Contributor: LCEDA_Lib
A2 D2 NRST NRST2 = TS-1145A-C-A: Supplier: LCSC; Supplier Part: C318903; Manufacturer: XKB Enterprise; Contributor: LCSC; JLCPCB Part Class: Extended Part
D6 = LED-0805_R: Manufacturer: EVERLIGHT(台湾亿光); Manufacturer Part: 17-21SURC/S530-A3/TR8; Supplier Part: C72037; Contributor: LCEDA_Lib
D7 = LED-0805_G: Manufacturer: 国星光电; Manufacturer Part: NCD0805G1; Supplier Part: C84260; Contributor: LCEDA_Lib
H2 H3 = HDR-F-2.54_2x8: Supplier Part: C30734; Supplier: LCSC; Contributor: LCEDA_Lib
H4 H11 H12 = HDR-F-2.54_2x15: Supplier Part: C169818; Supplier: LCSC; Contributor: LCEDA_Lib
H5 = HDR-F-2.54_1x9: Supplier Part: C124417; Supplier: LCSC; Contributor: LCEDA_Lib
J1 J2 = HDR-M-2.54_2x10: Supplier Part: C124359; Supplier: LCSC; Contributor: LCEDA_Lib
J3 J4 J6 = HDR-M-2.54_2x8: Supplier Part: C68234; Supplier: LCSC; Contributor: LCEDA_Lib
J8 = HDR-M-2.54_2x15: Supplier Part: C56496; Supplier: LCSC; Contributor: LCEDA_Lib
J9 = HDR-M-2.54_1x9: Supplier Part: C225484; Supplier: LCSC; Contributor: LCEDA_Lib
R1 R2 = R_0805_US: Supplier Part: C75781; Supplier: LCSC; Contributor: LCEDA_Lib; Manufacturer Part: TC0525F1001T5E; Manufacturer: UniOhm
BUZZER1 = SMD-8503-3627-16Ω: Supplier: LCSC; Supplier Part: C2685545; Manufacturer: S&S; Contributor: LCSC; JLCPCB Part Class: Extended Part
H13 = HDR-F-2.54_1x3: Supplier Part: C146690; Supplier: LCSC; Contributor: LCEDA_Lib
J11 = HDR-M-2.54_2x3: Supplier Part: C65114; Supplier: LCSC; Contributor: LCEDA_Lib
J15 = HDR-M-2.54_1x3: Supplier Part: C180248; Supplier: LCSC; Contributor: LCEDA_Lib
MIC1 = S15OT421-005: Supplier: LCSC; Supplier Part: C2684419; Manufacturer: Goertek(歌尔); Contributor: LCSC; JLCPCB Part Class: Extended Part
Q2 = S8550_C2828467: Supplier: LCSC; Supplier Part: C2828467; Manufacturer: CBI(创基); Manufacturer Part: S8550; Contributor: LCSC; JLCPCB Part Class: Extended Part
SPK1 = FS-1340: Supplier: LCSC; Supplier Part: C482342; Manufacturer: FUET(福声科技); JLCPCB Part Class: Extended Part; Contributor: LCSC
U1 = SD18OB261-060: Supplier: LCSC; Supplier Part: C2895290; Manufacturer: Goertek(歌尔); JLCPCB Part Class: Extended Part; Contributor: LCSC
U6 = LM358_C2984960: Supplier: LCSC; Supplier Part: C2984960; Manufacturer: HX(恒佳兴); Manufacturer Part: LM358; link: https://atta.szlcsc.com/upload/public/pdf/source/20220411/BF8A74874B47C6BB2B58E6B995D1DE82.pdf; subpart_no: 1; Contributor: lcsc; JLCPCB Part Class: Extended Part
U8 = NS8002: Supplier: LCSC; Supplier Part: C189960; Manufacturer: Shenzhen Nsiway Tech; Contributor: LCSC; JLCPCB Part Class: Extended Part

## Nets
3V3: C1.2 C3.2 C17.2 CARD1.4(VDD) FPC3.8 FPC3.9 FPC3.19 H5.4 H5.5 H5.6 H8.2 H8.20 J9.4 J9.5 J9.6 R3.2 R4.2 R5.2 R12.1 R13.1 R14.1 R15.1 R16.1 R24.2 U2.3(VDD) U3.3(VDD) U4.1(A0) U4.8(VCC) U16.3(VDD)
3V3_1: C4.2 R12.2 U5.8(VCC) U9.8(VCC)
3V3_2: C5.2 C13.2 R13.2 U7.4(VDD/VDDA) X1.4(VDD)
3V3_3: C6.2 H6.2 H7.7 H10.2 H14.2 R14.2
3V3_4: C14.2 MIC1.1(VDD) R15.2 U1.5(VDD)
3V3_5: C15.2 Q2.2(E) R9.2 R16.2 R17.2 U8.6(VDD)
3V3A: H2.7 J3.8 J4.7 R24.1
5V: C2.2 H2.9 H5.7 H5.8 H5.9 J3.10 J4.9 J9.7 J9.8 J9.9 R20.1 U6.8(VCC)
AGND: H4.3 H12.4 J8.3
AVDD: H1.6 H4.1 H12.2 J1.5 J2.6 J8.1
GND: A2.1 A2.2 BUZZER1.2 BUZZER1.3 BUZZER1.4 C1.1 C2.1 C3.1 C4.1 C5.1 C6.1 C7.1 C10.2 C11.1 C12.1 C13.1 C14.1 C15.1 C16.1 C17.1 CARD1.6(VSS) D2.1 D2.2 D6.2 D7.2 FPC3.6 FPC3.17 FPC3.20 H1.8 H2.11 H2.13 H3.12 H4.5 H4.17 H4.22 H4.27 H5.1 H5.2 H5.3 H6.1 H7.2 H8.1 H8.19 H10.1 H11.11 H11.24 H12.6 H12.18 H12.21 H12.28 H13.3 H14.1 J1.7 J2.8 J3.12 J3.14 J4.11 J4.13 J6.12 J8.5 J8.17 J8.22 J8.27 J9.1 J9.2 J9.3 J10.2 J13.1 MIC1.2(GND) MIC1.3(GND) NRST.1 NRST.2 NRST2.1 NRST2.2 R21.1 R23.2 SPK1.3 SPK1.4 U1.3(GND) U2.1(GND) U3.1(GND) U4.2(A1) U4.3(A2) U4.4(GND) U4.7(WP) U5.4(GND) U6.4(VEE/GND) U7.5(VSS/VSSA) U8.7(GND) U9.4(GND) U16.2(VSS) U16.6(A0) X1.2(GND)
VIN: H2.15 J3.16 J4.15
A0: H3.1 H11.2 J6.1 U7.7(PA0)
A1: C8.1 H3.3 H11.4 J6.3 MIC1.4(OUT) U7.8(PA1)
A2: A2.3 A2.4 H3.5 H11.6 J6.5 R22.2 R23.1 U7.9(PA2)
A3: H3.7 H11.8 J6.7 U7.10(PA3)
A4: H3.9 H11.10 J6.9 U7.11(PA4)
A5: H3.11 H11.12 J6.11
A6: H4.7 H12.8 J8.7
A7: H4.9 H12.10 J8.9
A8: H4.11 H12.12 J8.11
D0: H8.4
D2: D2.3 D2.4 H4.12 H12.11 J8.12 U7.12(PA5)
D3: H4.10 H7.3 H12.9 J8.10 U7.13(PA6)
D4: H4.8 H7.5 H12.7 J8.8 U7.14(PA7)
D5: H4.6 H7.6 H12.5 J8.6 U7.15(PB0)
D6: H4.4 H7.4 H12.3 J8.4 R1.2 U7.16(PB1) U9.3(WP#(IO2))
D7: H4.2 H12.1 J8.2 R2.2 U7.17(PB2)
D8: H1.20 H6.8 H14.7 J1.19 J2.20 U7.18(PA8)
D9: H1.18 H6.3 H14.6 J1.17 J2.18 U7.20(PC6)
D12: H8.15
D16: H1.1 H8.7 J1.2 J2.1 U1.4(CLK)
D17: H1.3 J1.4 J2.3
D18: H1.5 J1.6 J2.5
D19: H1.7 J1.8 J2.7
D20: H1.9 H10.3 J1.10 J2.9 J14.2
D21: H1.11 H8.10 H10.8 J1.12 J2.11
D24: H8.6
D32: H4.29 H8.18 H12.30 J8.29
D37: H4.30 H12.29 J8.30 U7.25(PA14-BOOT0)
D38: H4.28 H12.27 J8.28 U7.24(PA13)
D39: H4.26 H12.25 J8.26
D40: H4.24 H12.23 J8.24 U9.7(HOLD# or RESET#(IO3))
D41: H4.20 H12.19 J8.20 R5.1 U2.2(DQ) U3.2(DQ) U9.5(DI(IO0))
D42: H4.18 H12.17 J8.18 U9.2(DO(IO1))
D43: CARD1.7(DAT0) H2.2 H8.9 J3.1 J4.2
D44: CARD1.8(DAT1) H2.4 H8.12 J3.3 J4.4
D45: CARD1.1(DAT2) H2.6 J3.5 J4.6
D46: CARD1.2(CD/DAT3) H2.8 J3.7 J4.8 J12.4
D47: CARD1.5(CLK) H2.10 J3.9 J4.10
D48: CARD1.3(CMD) H2.12 J3.11 J4.12
D49: H2.14 J3.13 J4.14
D50: H2.16 J3.15 J4.16
D51: H3.2 H11.1 J6.2
D52: H3.4 H11.3 J6.4
D53: H3.6 H11.5 J6.6
D54: H3.8 H11.7 J6.8
D55: H3.10 H8.14 H11.9 J6.10
D56: H3.14 H11.13 J6.14 U1.2(L/R)
D57: H3.16 H8.11 H11.15 J6.16 U1.1(Data)
D58: H8.13 H11.17
D59: H8.16 H11.19
D60: H11.21
D61: H11.23
D62: H11.25
D63: H11.27
D64: H8.17 H11.29
D65: H8.8 H11.30
D66: FPC3.11 H11.28
D67: FPC3.7 H11.26
D68: FPC3.5 H11.22
D69: H11.20
D70: H11.18
D71: H3.15 H11.16 J6.15
D72: H3.13 H11.14 J6.13
DAC1_O: C16.2 J5.1 J5.2 U16.1(VOUT)
Dxx: R10.1
IOREF: H2.3 J3.4 J4.3
MISO: H1.12 H6.7 J1.11 J2.12 U7.28(PB4)
MISO2: H1.19 H10.7 J1.20 J2.19 U7.30(PB6)
MOSI: H1.14 H6.6 H14.4 J1.13 J2.14 U7.29(PB5)
MOSI2: H1.13 H10.6 J1.14 J2.13 U7.31(PB7)
NRST: FPC3.10 H2.5 H14.5 J3.6 J4.5 NRST.3 NRST.4
NRST2: J10.1 NRST2.3 NRST2.4 U7.6(PF2-NRST)
NSS: H1.16 H6.4 J1.15 J2.16 J14.1 U7.26(PA15)
NSS2: C7.2 H1.17 H10.4 J1.18 J2.17 U7.1(PB9)
QCLK: FPC3.12 H4.15 H12.16 J8.15 U5.6(CLK) U9.6(CLK)
QCS: FPC3.18 H4.13 H12.14 J8.13 J12.2
QCS_F1: J12.1 R3.1 U5.1(CS#)
QCS_F2: J12.3 R4.1 U9.1(CS#)
QD0: FPC3.16 H4.23 H12.24 J8.23 U5.5(DI(IO0))
QD1: FPC3.15 H4.21 H12.22 J8.21 U5.2(DO(IO1))
QD2: FPC3.14 H4.25 H12.26 J8.25 U5.3(WP#(IO2))
QD3: FPC3.13 H4.19 H12.20 J8.19 U5.7(HOLD#(IO3))
SCK: H1.10 H6.5 H14.3 J1.9 J2.10 J11.1 J11.2 U7.27(PB3)
SCK2: H1.15 H10.5 J1.16 J2.15 U7.32(PB8)
SCL: H1.2 H8.3 J1.1 J2.2 U4.6(SCL) U7.22(PA11[PA9]) U16.5(SCL)
SDA: H1.4 H8.5 J1.3 J2.4 U4.5(SDA) U7.23(PA12[PA10]) U16.4(SDA)
SPK1: J11.4 R6.1
SPK2: C9.1 J11.3
URX: H4.16 H7.1 H12.15 J8.16 U7.19(PA9)
UTX: H4.14 H7.8 H12.13 J8.14 U7.21(PA10)
VO1: J15.3 R8.2 SPK1.2(-) U8.5(VO1)
VO2: J15.1 SPK1.1(+) U8.8(VO2)
VO3: BUZZER1.1 J15.2 Q2.3(C)
Net-(C8-2): C8.2 R18.1
Net-(C9-2): C9.2 R7.1
Net-(C10-1): C10.1 U8.2(Bypass) U8.3(+IN)
Net-(C11-2): C11.2 R10.2 R11.1
Net-(C12-2): C12.2 J11.5 J11.6 R11.2
Net-(D6-1): D6.1 R1.1
Net-(D7-1): D7.1 R2.1
Net-(H13-1): H13.1 U6.6(IN2-) U6.7(OUT2)
Net-(H13-2): H13.2 U6.5(IN2+)
Net-(J13-2): J13.2 R9.1 U8.1(SD)
Net-(Q2-1): Q2.1(B) R6.2 R17.1
Net-(R7-2): R7.2 R8.1 U8.4(-IN)
Net-(R18-2): R18.2 R19.2 U6.2(IN1-)
Net-(R19-1): R19.1 R22.1 U6.1(OUT1)
Net-(R20-2): R20.2 R21.2 U6.3(IN1+)
Net-(U7-2): U7.2(PC14-OSC32_IN) X1.3(OUT)

Not connected (* = marked no-connect by the designer): CARD1 9(SW_CONTACT) 10(SW_SPRING) 11(SHELL); FPC3 1 2 3 4 21 22; H2 1; H14 8; J3 2; J4 1; U7 3(PC15-OSC32_OUT); X1 1(OE)

## Notes on the sheets
sheet 1
- WKUP
sheet 3
- D37: SWCLK
  D38: SWDIO
- PA0:WKUP1
  PA2:WKUP4
  PA4:WKUP2
sheet 4
- DFSDM
- DAC+PWM
sheet 5
- 1.3 240x240 tft
sheet 6
- NRF24L01
- ESP8266
- NRF24L01
